# Altium schematic sheet SIM_NODE.SchDoc
size A
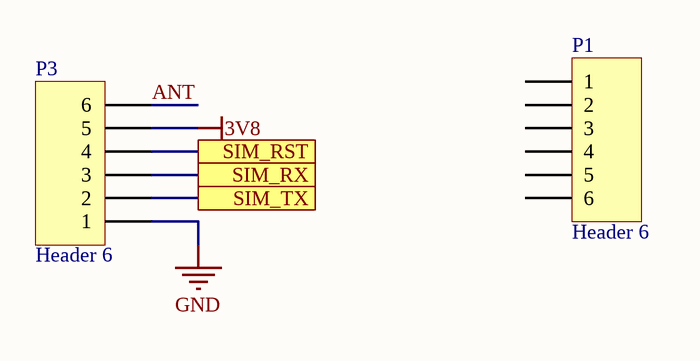
[diagram p0: SIM_NODE.SchDoc]

## Parts
P1  Header 6  [Header 6]
P3  Header 6  [Header 6]

## Ports
SIM_RST, SIM_RX, SIM_TX

## Nets
3V8: P3.5
GND: P3.1
ANT: P3.6
SIM_RST: P3.4 ; port SIM_RST
SIM_RX: P3.3 ; port SIM_RX
SIM_TX: P3.2 ; port SIM_TX

Not connected (* = marked no-connect by the designer): P1 1 2 3 4 5 6

## Library data of the parts
P1 P3 = Header 6: Header, 6-Pin; LatestRevisionDate: 17-Jul-2002; LatestRevisionNote: Re-released for DXP Platform.; Publisher: Altium Limited